# EAGLE design heater-v1 (EAGLE 7.7.0)
DESIGNER: K. GOBA
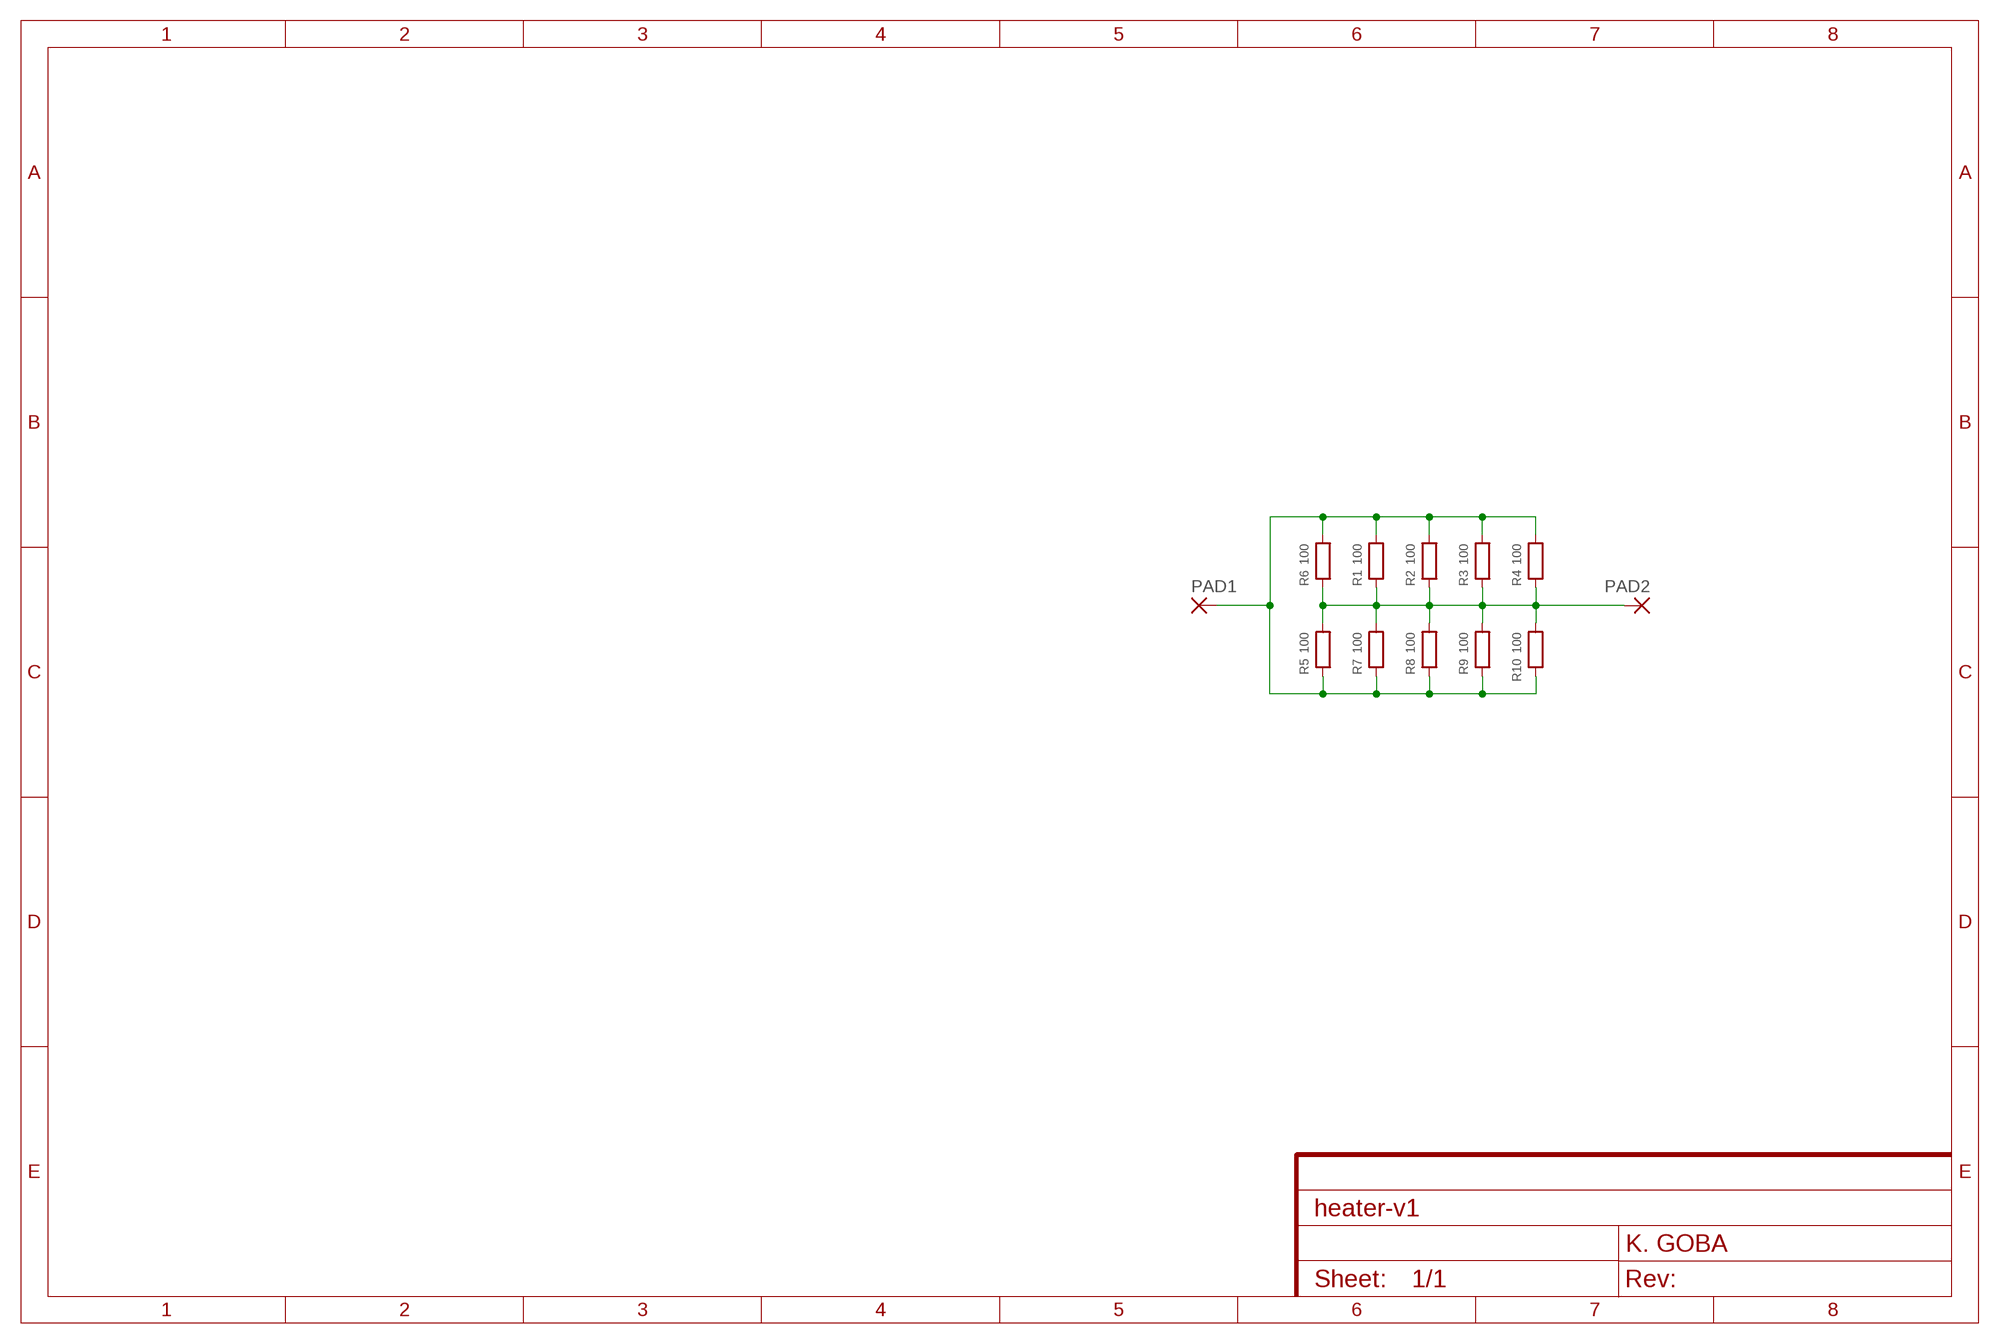
[diagram p0: schematic, sheet 1]

## Parts
PAD1  1,6/0,8  [1,6/0,8]
PAD2  1,6/0,8  [1,6/0,8]
R1  100  RESISTOR-1206  [R1206]
R2  100  RESISTOR-1206  [R1206]
R3  100  RESISTOR-1206  [R1206]
R4  100  RESISTOR-1206  [R1206]
R5  100  RESISTOR-1206  [R1206]
R6  100  RESISTOR-1206  [R1206]
R7  100  RESISTOR-1206  [R1206]
R8  100  RESISTOR-1206  [R1206]
R9  100  RESISTOR-1206  [R1206]
R10  100  RESISTOR-1206  [R1206]

## Nets
N1: PAD1.1(P) R1.2 R2.2 R3.2 R4.2 R5.1 R6.2 R7.1 R8.1 R9.1 R10.1
N2: PAD2.1(P) R1.1 R2.1 R3.1 R4.1 R5.2 R6.1 R7.2 R8.2 R9.2 R10.2

## Library data of the parts
PAD1 PAD2 = wirepad:1,6/0,8: THROUGH-HOLE PAD
R1-R10 = kg-generic:RESISTOR: Generic resistor

## Board
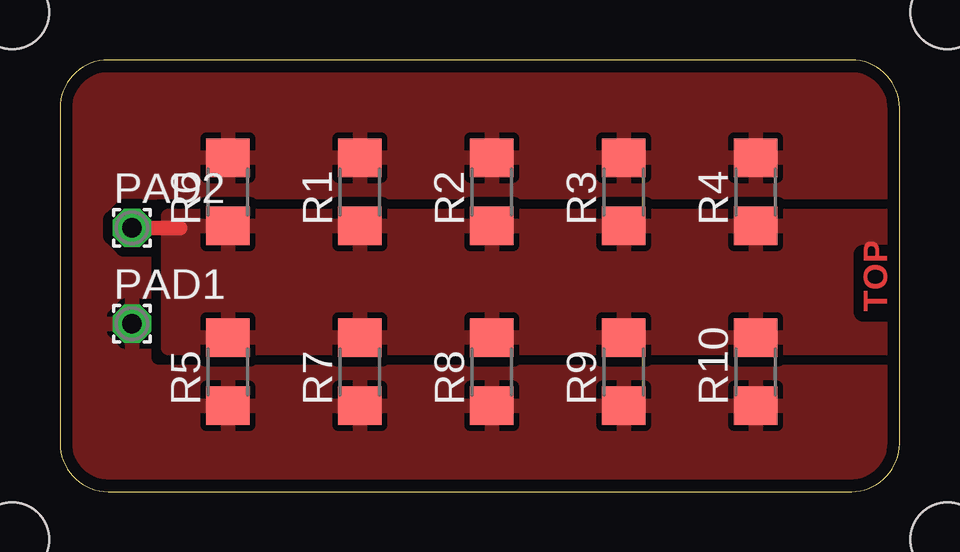
[diagram p1: board, top side]

Size 35 x 18 mm. Coordinates in mm from the lower left corner, seen from the top.
Outline: 35,2 35,16 arc90 33,18 2,18 arc90 0,16 0,2 arc90 2,0 33,0 arc90 35,2
Copper layers (1*16): Top 0.035mm / dielectric 1.5mm / Bottom 0.035mm
Design rules "ShenZhen2U_2layer_EagleRules *": minimum track width 7mil, minimum drill 12mil, track to track 7mil, track to pad 7mil, pad to pad 7mil, via to via 7mil, smd to smd 0mil, copper to edge 20mil, drill to drill 10mil, minimum pad ring 14mil, minimum via ring 6mil, stop-mask expansion 2mil, vias tented up to drill 25mil, thermal gap 10mil
Holes 3.1 mm at 37,20 -2,-2 37,-2 -2,20

### Footprints (pad centres in the part's own frame; a part is rotated, then mirrored left to right if it is on the bottom)
1,6/0,8 = drill 0.813 pad 1.6 octagon: 1 0,0
R1206 = smd 1.6 x 1.803: 1 -1.422,0; 2 1.422,0

### Placement (x,y rotation side)
PAD1  3,7 0 top
PAD2  3,11 0 top
R1  12.5,12.5 90 top
R2  18,12.5 90 top
R3  23.5,12.5 90 top
R4  29,12.5 90 top
R5  7,5 90 top
R6  7,12.5 90 top
R7  12.5,5 90 top
R8  18,5 90 top
R9  23.5,5 90 top
R10  29,5 90 top

### Tracks (layer width: path | path; a pad name or v marks a point on that pad's centre or on a via)
N1
  pour Top (isolate 0.406, rank 3): 35,0 0,0 0,18 35,18
N2
  Top 0.61: PAD2.1 5,11
  pour Top (isolate 0.406, rank 2): 35,6 4.5,6 4.5,11.5 35,11.5

### Text on the board
Top: TOP
Document: TODO: / - TABS for battery straps / - Check buzzer size / - Wire widths